# Altium schematic sheet P13 Hi3519 MIPI&I2C.SchDoc
size 420 x 297 mm
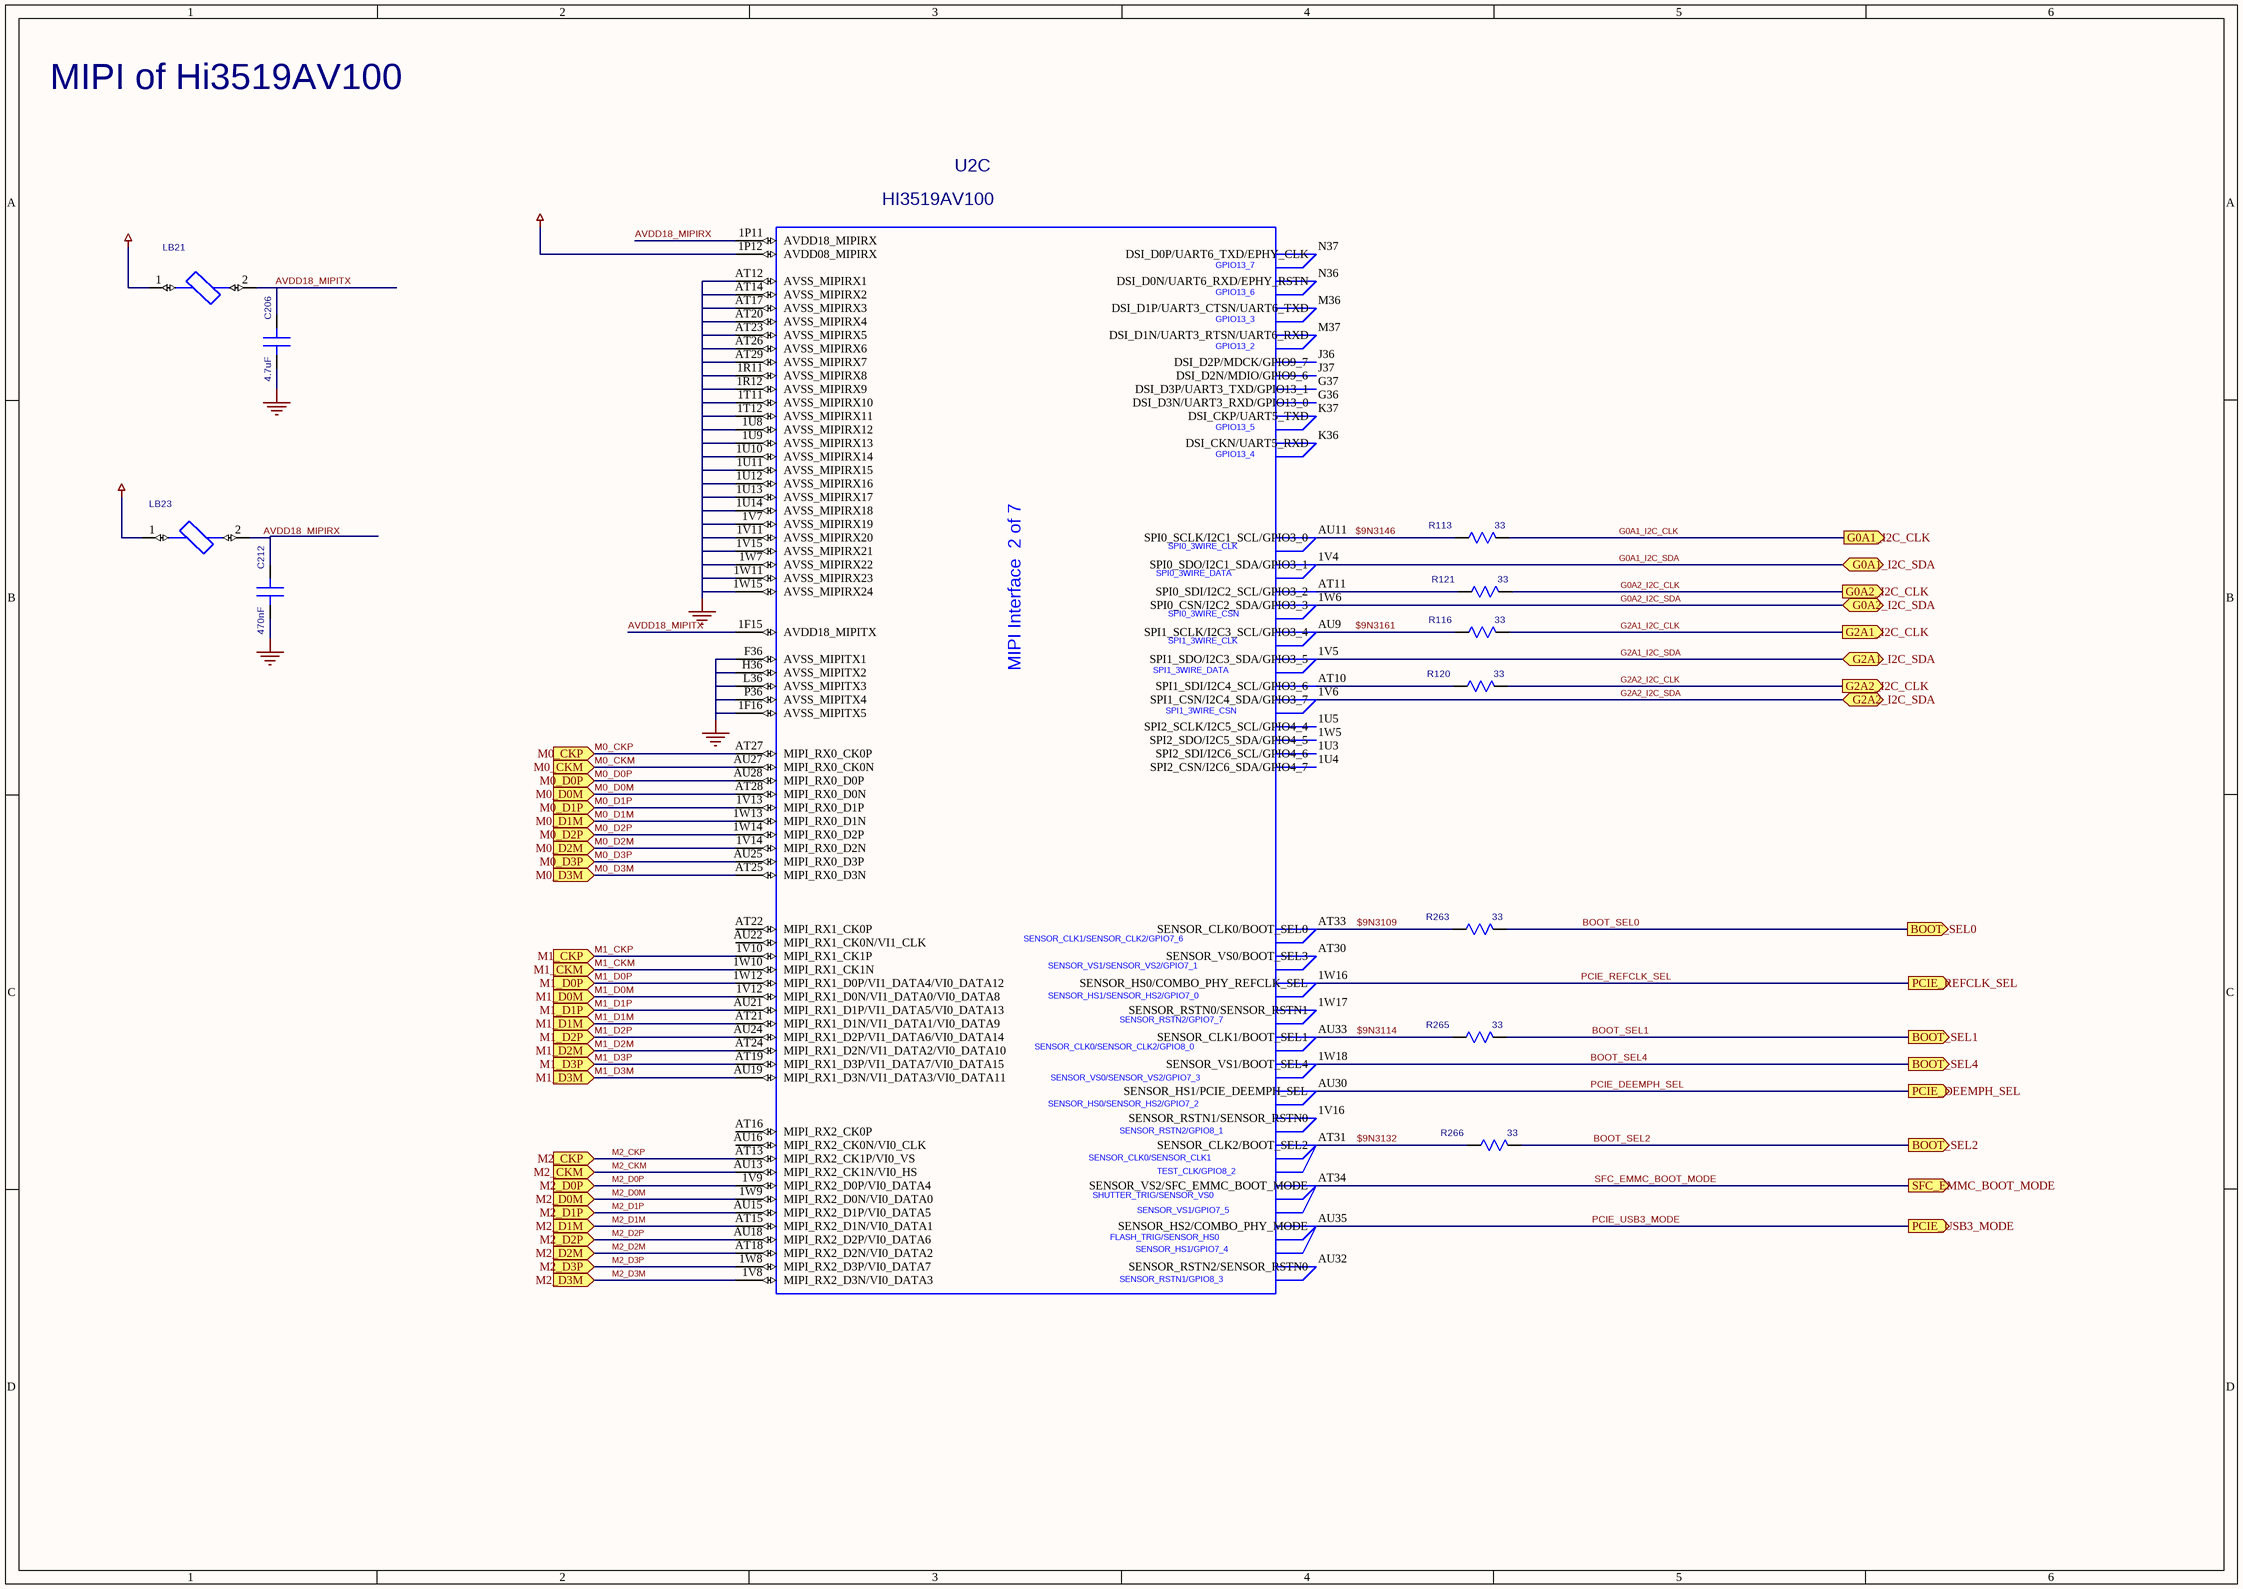
[diagram p0: P13 Hi3519 MIPI&I2C.SchDoc]

## Parts
C206  4.7uF  [SC0402-BGA]
C212  470nF  [SC0402-BGA]
LB21  LB  [SL0402]  (value not drawn)
LB23  LB  [SL0402]  (value not drawn)
R113  33  [SR0402]
R116  33  [SR0402]
R120  33  [SR0402]
R121  33  [SR0402]
R263  33  [SR0402]
R265  33  [SR0402]
R266  33  [SR0402]
U2  DEVICE: HI3519AV100  [HBGA567-16-3737]  (hidden comment: HI3519A_VO)  (part C of 7)

## Ports
BOOT_SEL0, BOOT_SEL1, BOOT_SEL2, BOOT_SEL4, G0A1_I2C_CLK, G0A1_I2C_SDA, G0A2_I2C_CLK, G0A2_I2C_SDA, G2A1_I2C_CLK, G2A1_I2C_SDA, G2A2_I2C_CLK, G2A2_I2C_SDA, M0_CKM, M0_CKP, M0_D0M, M0_D0P, M0_D1M, M0_D1P, M0_D2M, M0_D2P, M0_D3M, M0_D3P, M1_CKM, M1_CKP, M1_D0M, M1_D0P, M1_D1M, M1_D1P, M1_D2M, M1_D2P, M1_D3M, M1_D3P, M2_CKM, M2_CKP, M2_D0M, M2_D0P, M2_D1M, M2_D1P, M2_D2M, M2_D2P, M2_D3M, M2_D3P, PCIE_DEEMPH_SEL, PCIE_REFCLK_SEL, PCIE_USB3_MODE, SFC_EMMC_BOOT_MODE

## Nets
1V8: LB21.1 LB23.1
DVDD: U2.1P12(AVDD08_MIPIRX)
GND: C206.2(B) C212.2(B) U2.1F16(AVSS_MIPITX5) U2.1R11(AVSS_MIPIRX8) U2.1R12(AVSS_MIPIRX9) U2.1T11(AVSS_MIPIRX10) U2.1T12(AVSS_MIPIRX11) U2.1U8(AVSS_MIPIRX12) U2.1U9(AVSS_MIPIRX13) U2.1U10(AVSS_MIPIRX14) U2.1U11(AVSS_MIPIRX15) U2.1U12(AVSS_MIPIRX16) U2.1U13(AVSS_MIPIRX17) U2.1U14(AVSS_MIPIRX18) U2.1V7(AVSS_MIPIRX19) U2.1V11(AVSS_MIPIRX20) U2.1V15(AVSS_MIPIRX21) U2.1W7(AVSS_MIPIRX22) U2.1W11(AVSS_MIPIRX23) U2.1W15(AVSS_MIPIRX24) U2.AT12(AVSS_MIPIRX1) U2.AT14(AVSS_MIPIRX2) U2.AT17(AVSS_MIPIRX3) U2.AT20(AVSS_MIPIRX4) U2.AT23(AVSS_MIPIRX5) U2.AT26(AVSS_MIPIRX6) U2.AT29(AVSS_MIPIRX7) U2.F36(AVSS_MIPITX1) U2.H36(AVSS_MIPITX2) U2.L36(AVSS_MIPITX3) U2.P36(AVSS_MIPITX4)
$9N3109: R263.1(A) U2.AT33(SENSOR_CLK0/BOOT_SEL0)
$9N3114: R265.1(A) U2.AU33(SENSOR_CLK1/BOOT_SEL1)
$9N3132: R266.1(A) U2.AT31(SENSOR_CLK2/BOOT_SEL2)
$9N3146: R113.1(A) U2.AU11(SPI0_SCLK/I2C1_SCL/GPIO3_0)
$9N3161: R116.1(A) U2.AU9(SPI1_SCLK/I2C3_SCL/GPIO3_4)
AVDD18_MIPIRX: C212.1(A) LB23.2 U2.1P11(AVDD18_MIPIRX)
AVDD18_MIPITX: C206.1(A) LB21.2 U2.1F15(AVDD18_MIPITX)
BOOT_SEL0: R263.2(B) ; port BOOT_SEL0
BOOT_SEL1: R265.2(B) ; port BOOT_SEL1
BOOT_SEL2: R266.2(B) ; port BOOT_SEL2
BOOT_SEL4: U2.1W18(SENSOR_VS1/BOOT_SEL4) ; port BOOT_SEL4
G0A1_I2C_CLK: R113.2(B) ; port G0A1_I2C_CLK
G0A1_I2C_SDA: U2.1V4(SPI0_SDO/I2C1_SDA/GPIO3_1) ; port G0A1_I2C_SDA
G0A2_I2C_CLK: R121.2(B) ; port G0A2_I2C_CLK
G0A2_I2C_SDA: U2.1W6(SPI0_CSN/I2C2_SDA/GPIO3_3) ; port G0A2_I2C_SDA
G2A1_I2C_CLK: R116.2(B) ; port G2A1_I2C_CLK
G2A1_I2C_SDA: U2.1V5(SPI1_SDO/I2C3_SDA/GPIO3_5) ; port G2A1_I2C_SDA
G2A2_I2C_CLK: R120.2(B) ; port G2A2_I2C_CLK
G2A2_I2C_SDA: U2.1V6(SPI1_CSN/I2C4_SDA/GPIO3_7) ; port G2A2_I2C_SDA
M0_CKM: U2.AU27(MIPI_RX0_CK0N) ; port M0_CKM
M0_CKP: U2.AT27(MIPI_RX0_CK0P) ; port M0_CKP
M0_D0M: U2.AT28(MIPI_RX0_D0N) ; port M0_D0M
M0_D0P: U2.AU28(MIPI_RX0_D0P) ; port M0_D0P
M0_D1M: U2.1W13(MIPI_RX0_D1N) ; port M0_D1M
M0_D1P: U2.1V13(MIPI_RX0_D1P) ; port M0_D1P
M0_D2M: U2.1V14(MIPI_RX0_D2N) ; port M0_D2M
M0_D2P: U2.1W14(MIPI_RX0_D2P) ; port M0_D2P
M0_D3M: U2.AT25(MIPI_RX0_D3N) ; port M0_D3M
M0_D3P: U2.AU25(MIPI_RX0_D3P) ; port M0_D3P
M1_CKM: U2.1W10(MIPI_RX1_CK1N) ; port M1_CKM
M1_CKP: U2.1V10(MIPI_RX1_CK1P) ; port M1_CKP
M1_D0M: U2.1V12(MIPI_RX1_D0N/VI1_DATA0/VI0_DATA8) ; port M1_D0M
M1_D0P: U2.1W12(MIPI_RX1_D0P/VI1_DATA4/VI0_DATA12) ; port M1_D0P
M1_D1M: U2.AT21(MIPI_RX1_D1N/VI1_DATA1/VI0_DATA9) ; port M1_D1M
M1_D1P: U2.AU21(MIPI_RX1_D1P/VI1_DATA5/VI0_DATA13) ; port M1_D1P
M1_D2M: U2.AT24(MIPI_RX1_D2N/VI1_DATA2/VI0_DATA10) ; port M1_D2M
M1_D2P: U2.AU24(MIPI_RX1_D2P/VI1_DATA6/VI0_DATA14) ; port M1_D2P
M1_D3M: U2.AU19(MIPI_RX1_D3N/VI1_DATA3/VI0_DATA11) ; port M1_D3M
M1_D3P: U2.AT19(MIPI_RX1_D3P/VI1_DATA7/VI0_DATA15) ; port M1_D3P
M2_CKM: U2.AU13(MIPI_RX2_CK1N/VI0_HS) ; port M2_CKM
M2_CKP: U2.AT13(MIPI_RX2_CK1P/VI0_VS) ; port M2_CKP
M2_D0M: U2.1W9(MIPI_RX2_D0N/VI0_DATA0) ; port M2_D0M
M2_D0P: U2.1V9(MIPI_RX2_D0P/VI0_DATA4) ; port M2_D0P
M2_D1M: U2.AT15(MIPI_RX2_D1N/VI0_DATA1) ; port M2_D1M
M2_D1P: U2.AU15(MIPI_RX2_D1P/VI0_DATA5) ; port M2_D1P
M2_D2M: U2.AT18(MIPI_RX2_D2N/VI0_DATA2) ; port M2_D2M
M2_D2P: U2.AU18(MIPI_RX2_D2P/VI0_DATA6) ; port M2_D2P
M2_D3M: U2.1V8(MIPI_RX2_D3N/VI0_DATA3) ; port M2_D3M
M2_D3P: U2.1W8(MIPI_RX2_D3P/VI0_DATA7) ; port M2_D3P
PCIE_DEEMPH_SEL: U2.AU30(SENSOR_HS1/PCIE_DEEMPH_SEL) ; port PCIE_DEEMPH_SEL
PCIE_REFCLK_SEL: U2.1W16(SENSOR_HS0/COMBO_PHY_REFCLK_SEL) ; port PCIE_REFCLK_SEL
PCIE_USB3_MODE: U2.AU35(SENSOR_HS2/COMBO_PHY_MODE) ; port PCIE_USB3_MODE
SFC_EMMC_BOOT_MODE: U2.AT34(SENSOR_VS2/SFC_EMMC_BOOT_MODE) ; port SFC_EMMC_BOOT_MODE
NetR120_1: R120.1(A) U2.AT10(SPI1_SDI/I2C4_SCL/GPIO3_6)
NetR121_1: R121.1(A) U2.AT11(SPI0_SDI/I2C2_SCL/GPIO3_2)

Not connected (* = marked no-connect by the designer): U2 1U3(SPI2_SDI/I2C6_SCL/GPIO4_6) 1U4(SPI2_CSN/I2C6_SDA/GPIO4_7) 1U5(SPI2_SCLK/I2C5_SCL/GPIO4_4) 1V16(SENSOR_RSTN1/SENSOR_RSTN0) 1W5(SPI2_SDO/I2C5_SDA/GPIO4_5) 1W17(SENSOR_RSTN0/SENSOR_RSTN1) AT16(MIPI_RX2_CK0P) AT22(MIPI_RX1_CK0P) AT30(SENSOR_VS0/BOOT_SEL3) AU16(MIPI_RX2_CK0N/VI0_CLK) AU22(MIPI_RX1_CK0N/VI1_CLK) AU32(SENSOR_RSTN2/SENSOR_RSTN0) G36(DSI_D3N/UART3_RXD/GPIO13_0) G37(DSI_D3P/UART3_TXD/GPIO13_1) J36(DSI_D2P/MDCK/GPIO9_7) J37(DSI_D2N/MDIO/GPIO9_6) K36(DSI_CKN/UART5_RXD) K37(DSI_CKP/UART5_TXD) M36(DSI_D1P/UART3_CTSN/UART6_TXD) M37(DSI_D1N/UART3_RTSN/UART6_RXD) N36(DSI_D0N/UART6_RXD/EPHY_RSTN) N37(DSI_D0P/UART6_TXD/EPHY_CLK)

## Notes on the sheet
- MIPI of Hi3519AV100
- (in symbol HI3519A_VO_5, part C) GPIO13_7; GPIO13_6; GPIO13_3; GPIO13_2; GPIO13_5; GPIO13_4; SPI0_3WIRE_CLK; SPI0_3WIRE_DATA; SPI0_3WIRE_CSN; SPI1_3WIRE_CLK; MIPI Interface  2 of 7; SPI1_3WIRE_DATA; SPI1_3WIRE_CSN; SENSOR_CLK1/SENSOR_CLK2/GPIO7_6; SENSOR_VS1/SENSOR_VS2/GPIO7_1; SENSOR_HS1/SENSOR_HS2/GPIO7_0; SENSOR_RSTN2/GPIO7_7; SENSOR_CLK0/SENSOR_CLK2/GPIO8_0; SENSOR_VS0/SENSOR_VS2/GPIO7_3; SENSOR_HS0/SENSOR_HS2/GPIO7_2; SENSOR_RSTN2/GPIO8_1; SENSOR_CLK0/SENSOR_CLK1; TEST_CLK/GPIO8_2; SHUTTER_TRIG/SENSOR_VS0; SENSOR_VS1/GPIO7_5; FLASH_TRIG/SENSOR_HS0; SENSOR_HS1/GPIO7_4; SENSOR_RSTN1/GPIO8_3

## Library data of the parts
C206 = C: PARTS: 1; OriginalSymbolOrigin: (0,0); DEVICE: CM05X6T475M06AH-HW; LEVEL: STD; PINSWAP: (A,B); CODE: 8072081; %195%%232%%202%%246%: SMD陶瓷电容-6.3V-4700nF-+/-20%-X6T-0402-华技终端专用; %182%%238%%182%%168%%185%%164%%215%%247%%181%%231%%209%%185%(V): 6.3; COMPONENT_HIGH_MAX: -999999mm; %208%%161%%192%%224%%195%%251%%179%%198%: SMD陶瓷电容; PKG_TYPE: SC0402-BGA
C212 = C: PARTS: 1; OriginalSymbolOrigin: (0,0); DEVICE: GRM155R71A474KE01D; LEVEL: STD; PINSWAP: (A,B); %208%%161%%192%%224%%195%%251%%179%%198%: SMD陶瓷电容; %195%%232%%202%%246%: SMD陶瓷电容-6.3V-470nF-+/-10%-X7R-0402; CODE: 8072110; COMPONENT_HIGH_MAX: -999999mm; %182%%238%%182%%168%%185%%164%%215%%247%%181%%231%%209%%185%(V): 6.3; PKG_TYPE: SC0402-BGA
LB21 = LB_Dup1: PARTS: 1; OriginalSymbolOrigin: (0,0); LEVEL: STD; DEVICE: BLM15BD601SN1D; CODE: 10070013; %195%%232%%202%%246%: EMI磁珠-+/-25%-600ohm-0.65ohm-0.2A-402; COMPONENT_HIGH_MAX: 0.55MM; %208%%161%%192%%224%%195%%251%%179%%198%: EMI磁珠; PKG_TYPE: SL0402
LB23 = LB_Dup1: PARTS: 1; OriginalSymbolOrigin: (0,0); LEVEL: STD; DEVICE: BLM15BD601SN1D; %208%%161%%192%%224%%195%%251%%179%%198%: EMI磁珠; COMPONENT_HIGH_MAX: 0.55MM; %195%%232%%202%%246%: EMI磁珠-+/-25%-600ohm-0.65ohm-0.2A-402; CODE: 10070013; PKG_TYPE: SL0402
R113 R265 R266 = R_Dup1: PARTS: 1; OriginalSymbolOrigin: (0,0); PINSWAP: (A,B); DEVICE: RC0402FR_0733RL; LEVEL: STD; CODE: 7090836; %195%%232%%202%%246%: 片式厚膜电阻器-0.0625W-33ohm-+/-1%-0402; %182%%238%%182%%168%%185%%166%%194%%202%(W): 0.06; %215%%232%%214%%181%%212%%202%%208%%237%%198%%171%%178%%238%: +/-1%; COMPONENT_HIGH_MAX: 0.4MM; %208%%161%%192%%224%%195%%251%%179%%198%: 片式厚膜电阻器; PKG_TYPE: SR0402
R116 R120 R121 R263 = R_Dup1: PARTS: 1; OriginalSymbolOrigin: (0,0); PINSWAP: (A,B); DEVICE: RC0402FR_0733RL; LEVEL: STD; %208%%161%%192%%224%%195%%251%%179%%198%: 片式厚膜电阻器; COMPONENT_HIGH_MAX: 0.4MM; %215%%232%%214%%181%%212%%202%%208%%237%%198%%171%%178%%238%: +/-1%; %182%%238%%182%%168%%185%%166%%194%%202%(W): 0.06; %195%%232%%202%%246%: 片式厚膜电阻器-0.0625W-33ohm-+/-1%-0402; CODE: 7090836; PKG_TYPE: SR0402
U2 = HI3519A_VO_5: PARTS: 1; OriginalSymbolOrigin: (0,0); LEVEL: STD; HETERO: (HI3519A_DDR),(HI3519A_MIPI),(HI3519A_PER),(HI3519A_SYS),(HI3519A_VO),(HI3519A_PWR),(HI3519A_VSS); CaptureCellPackProp: HI3519A_VOC; PKG_TYPE: HBGA567-16-3737